# Altium schematic sheet HalfBridge.SchDoc
size A
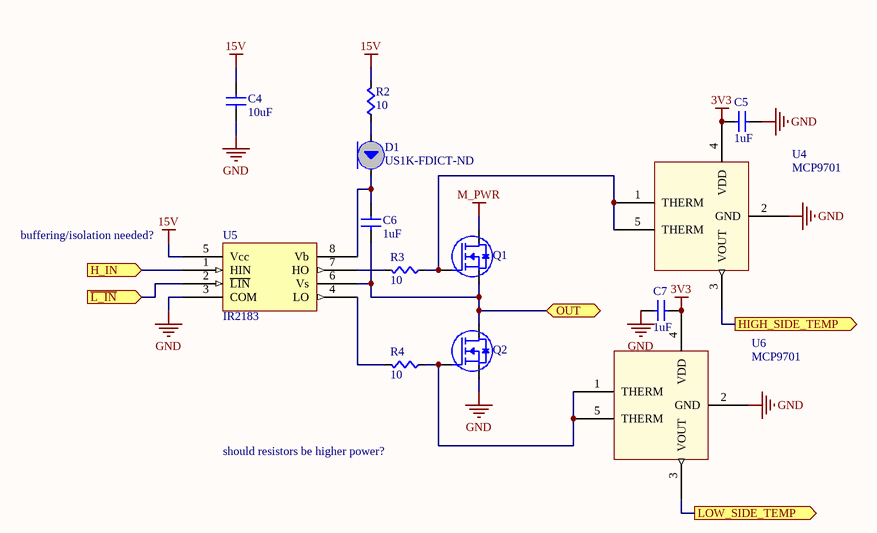
[diagram p0: HalfBridge.SchDoc]

## Parts
C4  value 10uF  [CAPC0603]  (hidden comment: Cap)
C5  value 1uF  [CAPC0603]  (hidden comment: Cap)
C6  value 1uF  [CAPC0603]  (hidden comment: Cap)
C7  value 1uF  [CAPC0603]  (hidden comment: Cap)
D1  Supplier Part Number 1: US1K-FDICT-ND  [US1K-13-F]  (hidden comment: US1K-13-F)
Q1  IRLU3636PbF  [IRLU3636PbF]  (value not drawn)
Q2  IRLU3636PbF  [IRLU3636PbF]  (value not drawn)
R2  value 10  [RES0603]  (hidden comment: Res)
R3  value 10  [RES0603]  (hidden comment: Res)
R4  value 10  [RES0603]  (hidden comment: Res)
U4  MCP9701  [MCP9701AT-E/LT]
U5  IR2183  [IR2183S]
U6  MCP9701  [MCP9701AT-E/LT]

## Ports
H_IN (in), HIGH_SIDE_TEMP (out), LOW_SIDE_TEMP (out), OUT (bidir), ~{L_IN} (in)

## Nets
3V3: C5.2(B) C7.1(A) U4.4(VDD) U6.4(VDD)
15V: C4.1(A) R2.1(A) U5.5(Vcc)
GND: C4.2(B) C5.1(A) C7.2(B) Q2.S U4.2(GND) U5.3(COM) U6.2(GND)
M_PWR: Q1.D
H_IN: U5.1(HIN) ; port H_IN
HIGH_SIDE_TEMP: U4.3(VOUT) ; port HIGH_SIDE_TEMP
~{L_IN}: U5.2(~{LIN}) ; port ~{L_IN}
LOW_SIDE_TEMP: U6.3(VOUT) ; port LOW_SIDE_TEMP
OUT: C6.2(B) Q1.S Q2.D U5.6(Vs) ; port OUT
NetC6_1: C6.1(A) D1.C U5.8(Vb)
NetD1_A: D1.A R2.2(B)
NetQ1_G: Q1.G R3.2(B) U4.1(THERM) U4.5(THERM)
NetQ2_G: Q2.G R4.2(B) U6.1(THERM) U6.5(THERM)
NetR3_1: R3.1(A) U5.7(HO)
NetR4_1: R4.1(A) U5.4(LO)

## Notes on the sheet
- (near U5) buffering/isolation needed?
- should resistors be higher power?

## Library data of the parts
D1 = US1K-13-F: 1.0A SURFACE MOUNT ULTRA-FAST RECTIFIER; Supplier 1: Digi-Key
Q1 Q2 = IRLU3636PbF: HEXFET Power MOSFET; Supplier 1: Digi-Key; Supplier Part Number 1: IRLU3636PBF-ND
U4 U6 = MCP9701AT-E/LT: Low-Power Linear Active Thermistor ICs; Supplier 1: Digi-Key; Supplier Part Number 1: MCP9701AT-E/LTCT-ND
U5 = IR2183: Half-Bridge Driver; Supplier 1: Digi-Key; Supplier Part Number 1: IR2183SPBF-ND
C4-C7 = Cap: Supplier 1: Digi-Key
  C4: Supplier Part Number 1: 445-9015-1-ND
  C5-C7: Supplier Part Number 1: 587-1248-1-ND
R2-R4 = Res: Supplier 1: Digi-Key; Supplier Part Number 1: RHM10CGCT-ND